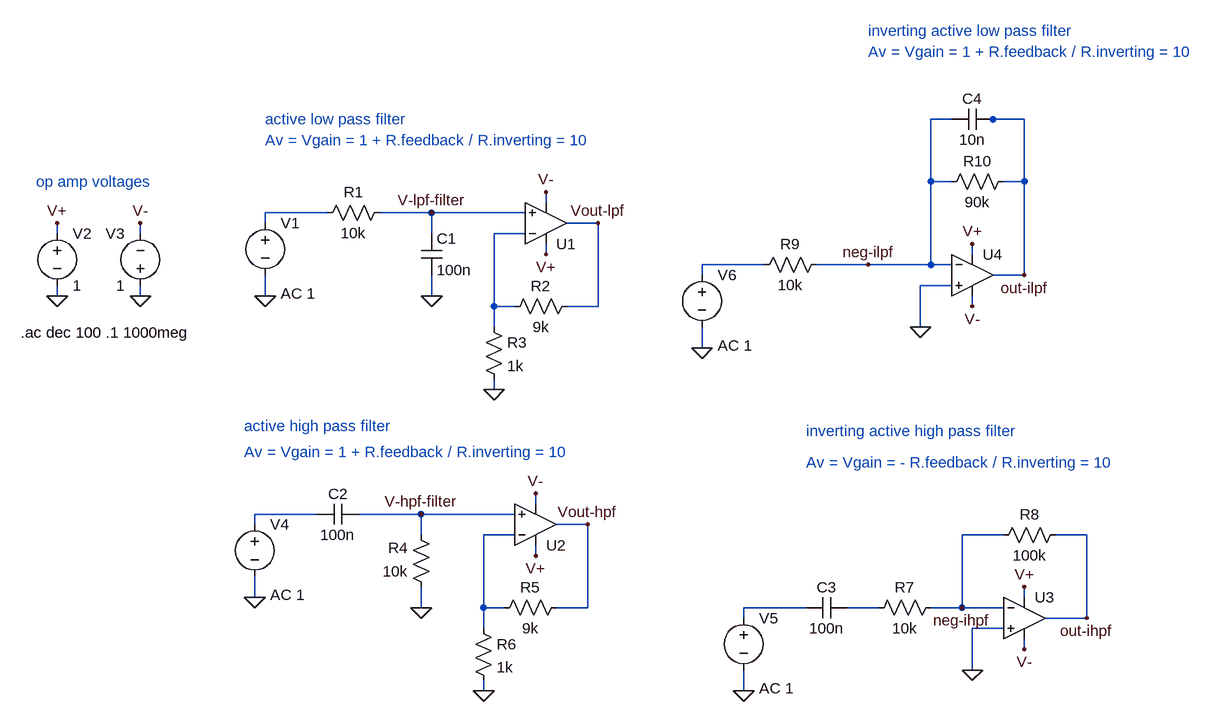
[diagram p0: schematic basic-active-filters.asc]
basic-active-filters.asc, the LTspice schematic file:
Version 4.1
SHEET 1 1628 836
WIRE 1200 -80 1168 -80
WIRE 1264 -80 1248 -80
WIRE 1312 -80 1264 -80
WIRE 1168 16 1168 -80
WIRE 1200 16 1168 16
WIRE 1312 16 1312 -80
WIRE 1312 16 1280 16
WIRE 576 48 576 32
WIRE 240 64 144 64
WIRE 400 64 320 64
WIRE 544 64 400 64
WIRE 144 80 144 64
WIRE 656 80 608 80
WIRE -176 96 -176 80
WIRE -48 96 -48 80
WIRE 400 96 400 64
WIRE 544 96 496 96
WIRE 576 128 576 112
WIRE 1232 128 1232 112
WIRE 912 144 816 144
WIRE 1072 144 992 144
WIRE 1168 144 1168 16
WIRE 1168 144 1072 144
WIRE 1200 144 1168 144
WIRE 816 160 816 144
WIRE 1312 160 1312 16
WIRE 1312 160 1264 160
WIRE 1200 176 1152 176
WIRE -176 192 -176 176
WIRE -48 192 -48 176
WIRE 144 192 144 160
WIRE 400 192 400 160
WIRE 496 208 496 96
WIRE 528 208 496 208
WIRE 656 208 656 80
WIRE 656 208 608 208
WIRE 1232 208 1232 192
WIRE 496 240 496 208
WIRE 1152 240 1152 176
WIRE 816 272 816 240
WIRE 496 336 496 320
WIRE 560 512 560 496
WIRE 224 528 128 528
WIRE 384 528 288 528
WIRE 528 528 384 528
WIRE 128 544 128 528
WIRE 640 544 592 544
WIRE 384 560 384 528
WIRE 528 560 480 560
WIRE 1280 560 1216 560
WIRE 1408 560 1360 560
WIRE 560 592 560 576
WIRE 128 656 128 624
WIRE 1312 656 1312 640
WIRE 384 672 384 640
WIRE 480 672 480 560
WIRE 512 672 480 672
WIRE 640 672 640 544
WIRE 640 672 592 672
WIRE 976 672 880 672
WIRE 1088 672 1040 672
WIRE 1216 672 1216 560
WIRE 1216 672 1168 672
WIRE 1280 672 1216 672
WIRE 880 688 880 672
WIRE 1408 688 1408 560
WIRE 1408 688 1344 688
WIRE 480 704 480 672
WIRE 1280 704 1232 704
WIRE 1312 736 1312 720
WIRE 1232 768 1232 704
WIRE 480 800 480 784
WIRE 880 800 880 768
FLAG 144 192 0
FLAG 400 192 0
FLAG -48 192 0
FLAG -176 192 0
FLAG -176 80 V+
FLAG -48 80 V-
FLAG 496 336 0
FLAG 656 80 Vout-lpf
FLAG 400 64 V-lpf-filter
FLAG 576 128 V+
FLAG 576 32 V-
FLAG 128 656 0
FLAG 384 672 0
FLAG 480 800 0
FLAG 640 544 Vout-hpf
FLAG 384 528 V-hpf-filter
FLAG 560 592 V+
FLAG 560 496 V-
FLAG 880 800 0
FLAG 1312 640 V+
FLAG 1312 736 V-
FLAG 1232 768 0
FLAG 1408 688 out-ihpf
FLAG 1216 672 neg-ihpf
FLAG 816 272 0
FLAG 1232 112 V+
FLAG 1232 208 V-
FLAG 1152 240 0
FLAG 1072 144 neg-ilpf
FLAG 1312 160 out-ilpf
SYMBOL voltage 144 64 R0
WINDOW 123 24 124 Left 2
WINDOW 39 0 0 Left 0
SYMATTR InstName V1
SYMATTR Value ""
SYMATTR Value2 AC 1
SYMBOL res 336 48 R90
WINDOW 0 0 56 VBottom 2
WINDOW 3 32 56 VTop 2
SYMATTR InstName R1
SYMATTR Value 10k
SYMBOL cap 384 96 R0
SYMATTR InstName C1
SYMATTR Value 100n
SYMBOL OpAmps\\UniversalOpAmp 576 80 M180
SYMATTR InstName U1
SYMBOL voltage -176 80 R0
WINDOW 123 0 0 Left 0
WINDOW 39 0 0 Left 0
SYMATTR InstName V2
SYMATTR Value 1
SYMBOL voltage -48 192 R180
WINDOW 0 24 96 Left 2
WINDOW 3 24 16 Left 2
WINDOW 123 0 0 Left 0
WINDOW 39 0 0 Left 0
SYMATTR InstName V3
SYMATTR Value 1
SYMBOL res 624 192 R90
WINDOW 0 0 56 VBottom 2
WINDOW 3 32 56 VTop 2
SYMATTR InstName R2
SYMATTR Value 9k
SYMBOL res 480 224 R0
SYMATTR InstName R3
SYMATTR Value 1k
SYMBOL voltage 128 528 R0
WINDOW 123 24 124 Left 2
WINDOW 39 0 0 Left 0
SYMATTR InstName V4
SYMATTR Value ""
SYMATTR Value2 AC 1
SYMBOL res 400 656 R180
WINDOW 0 36 76 Left 2
WINDOW 3 36 40 Left 2
SYMATTR InstName R4
SYMATTR Value 10k
SYMBOL cap 288 512 R90
WINDOW 0 0 32 VBottom 2
WINDOW 3 32 32 VTop 2
SYMATTR InstName C2
SYMATTR Value 100n
SYMBOL OpAmps\\UniversalOpAmp 560 544 M180
SYMATTR InstName U2
SYMBOL res 608 656 R90
WINDOW 0 0 56 VBottom 2
WINDOW 3 32 56 VTop 2
SYMATTR InstName R5
SYMATTR Value 9k
SYMBOL res 464 688 R0
SYMATTR InstName R6
SYMATTR Value 1k
SYMBOL voltage 880 672 R0
WINDOW 123 24 124 Left 2
WINDOW 39 0 0 Left 0
SYMATTR InstName V5
SYMATTR Value ""
SYMATTR Value2 AC 1
SYMBOL cap 1040 656 R90
WINDOW 0 0 32 VBottom 2
WINDOW 3 32 32 VTop 2
SYMATTR InstName C3
SYMATTR Value 100n
SYMBOL OpAmps\\UniversalOpAmp 1312 688 R0
SYMATTR InstName U3
SYMBOL res 1184 656 R90
WINDOW 0 0 56 VBottom 2
WINDOW 3 32 56 VTop 2
SYMATTR InstName R7
SYMATTR Value 10k
SYMBOL res 1376 544 R90
WINDOW 0 0 56 VBottom 2
WINDOW 3 32 56 VTop 2
SYMATTR InstName R8
SYMATTR Value 100k
SYMBOL voltage 816 144 R0
WINDOW 123 24 124 Left 2
WINDOW 39 0 0 Left 0
SYMATTR InstName V6
SYMATTR Value ""
SYMATTR Value2 AC 1
SYMBOL OpAmps\\UniversalOpAmp 1232 160 R0
SYMATTR InstName U4
SYMBOL res 1008 128 R90
WINDOW 0 0 56 VBottom 2
WINDOW 3 32 56 VTop 2
SYMATTR InstName R9
SYMATTR Value 10k
SYMBOL res 1296 0 R90
WINDOW 0 0 56 VBottom 2
WINDOW 3 32 56 VTop 2
SYMATTR InstName R10
SYMATTR Value 90k
SYMBOL cap 1264 -96 R90
WINDOW 0 0 32 VBottom 2
WINDOW 3 32 32 VTop 2
SYMATTR InstName C4
SYMATTR Value 10n
TEXT -208 16 Left 2 ;op amp voltages
TEXT -232 248 Left 2 !.ac dec 100 .1 1000meg
TEXT 144 -48 Left 2 ;Av = Vgain = 1 + R.feedback / R.inverting = 10
TEXT 144 -80 Left 2 ;active low pass filter
TEXT 112 392 Left 2 ;active high pass filter
TEXT 112 432 Left 2 ;Av = Vgain = 1 + R.feedback / R.inverting = 10
TEXT 976 400 Left 2 ;inverting active high pass filter
TEXT 976 448 Left 2 ;Av = Vgain = - R.feedback / R.inverting = 10
TEXT 1072 -184 Left 2 ;Av = Vgain = 1 + R.feedback / R.inverting = 10
TEXT 1072 -216 Left 2 ;inverting active low pass filter

The netlist it stands for:
* basic-active-filters.asc
V1 N001 0 AC 1
R1 V-lpf-filter N001 10k
C1 V-lpf-filter 0 100n
X§U1 V-lpf-filter N002 V+ V- Vout-lpf level1 Avol=1Meg GBW=10Meg Vos=0 En=0 Enk=0 In=0 Ink=0 Rin=500Meg  ; pins In+ In- V+ V- OUT
V2 V+ 0 1
V3 0 V- 1
R2 Vout-lpf N002 9k
R3 N002 0 1k
V4 N004 0 AC 1
R4 0 V-hpf-filter 10k
C2 V-hpf-filter N004 100n
X§U2 V-hpf-filter N005 V+ V- Vout-hpf level1 Avol=1Meg GBW=10Meg Vos=0 En=0 Enk=0 In=0 Ink=0 Rin=500Meg  ; pins In+ In- V+ V- OUT
R5 Vout-hpf N005 9k
R6 N005 0 1k
V5 N006 0 AC 1
C3 N007 N006 100n
X§U3 0 neg-ihpf V+ V- out-ihpf level1 Avol=1Meg GBW=10Meg Vos=0 En=0 Enk=0 In=0 Ink=0 Rin=500Meg  ; pins In+ In- V+ V- OUT
R7 neg-ihpf N007 10k
R8 out-ihpf neg-ihpf 100k
V6 N003 0 AC 1
X§U4 0 neg-ilpf V+ V- out-ilpf level1 Avol=1Meg GBW=10Meg Vos=0 En=0 Enk=0 In=0 Ink=0 Rin=500Meg  ; pins In+ In- V+ V- OUT
R9 neg-ilpf N003 10k
R10 out-ilpf neg-ilpf 90k
C4 out-ilpf neg-ilpf 10n
* op amp voltages
.ac dec 100 .1 1000meg
* Av = Vgain = 1 + R.feedback / R.inverting = 10
* active low pass filter
* active high pass filter
* Av = Vgain = 1 + R.feedback / R.inverting = 10
* inverting active high pass filter
* Av = Vgain = - R.feedback / R.inverting = 10
* Av = Vgain = 1 + R.feedback / R.inverting = 10
* inverting active low pass filter
.lib UniversalOpAmp1.lib
.backanno
.end